# EAGLE design HoneyCar (EAGLE 7.2.0)
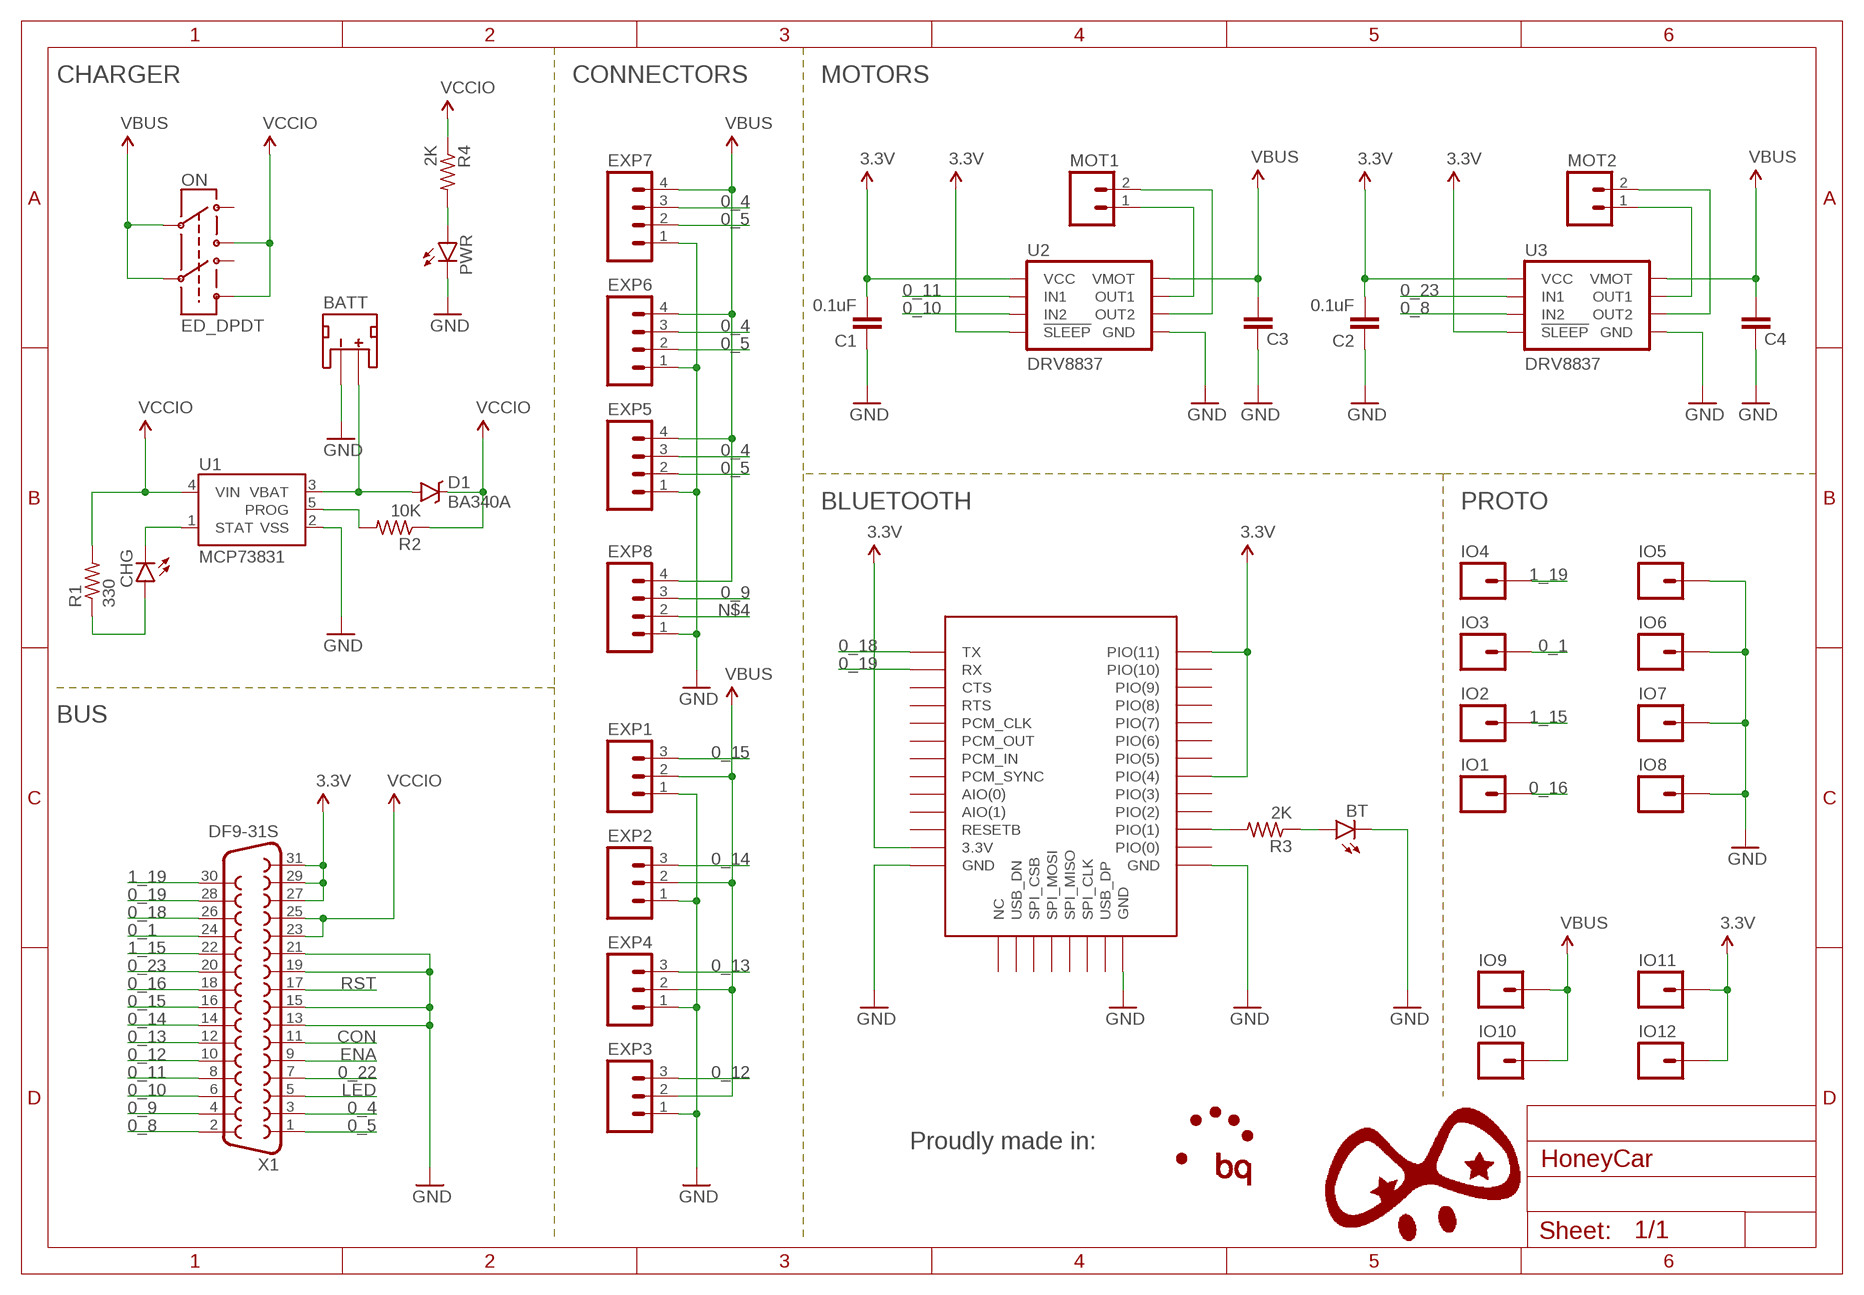
[diagram p0: schematic, sheet 1]

## Parts
BATT  JST_2MM_MALE  [JST-2-SMD]
BT  LED0603  [LED-0603]
C1  0.1uF  CAP0603-CAP  [0603-CAP]
C2  0.1uF  CAP0603-CAP  [0603-CAP]
C3  0.1uF  CAP0603-CAP  [0603-CAP]
C4  0.1uF  CAP0603-CAP  [0603-CAP]
CHG  LED0603  [LED-0603]
D1  BA340A  B340A  [SMA-DIODE]
EXP1  M03LOCK  [1X03_LOCK]
EXP2  M03LOCK  [1X03_LOCK]
EXP3  M03LOCK  [1X03_LOCK]
EXP4  M03LOCK  [1X03_LOCK]
EXP5  M04JST  [1X04-1.5MM_JST]
EXP6  M04JST  [1X04-1.5MM_JST]
EXP7  M04JST  [1X04-1.5MM_JST]
EXP8  M04JST  [1X04-1.5MM_JST]
IC1  BC04_BLUETOOTH  [BC04]
IO1  M01PTH_LONGPAD  [1X01_LONGPAD]
IO2  M01PTH_LONGPAD  [1X01_LONGPAD]
IO3  M01PTH_LONGPAD  [1X01_LONGPAD]
IO4  M01PTH_LONGPAD  [1X01_LONGPAD]
IO5  M01PTH_LONGPAD  [1X01_LONGPAD]
IO6  M01PTH_LONGPAD  [1X01_LONGPAD]
IO7  M01PTH_LONGPAD  [1X01_LONGPAD]
IO8  M01PTH_LONGPAD  [1X01_LONGPAD]
IO9  M01PTH_LONGPAD  [1X01_LONGPAD]
IO10  M01PTH_LONGPAD  [1X01_LONGPAD]
IO11  M01PTH_LONGPAD  [1X01_LONGPAD]
IO12  M01PTH_LONGPAD  [1X01_LONGPAD]
MOT1  M02POLAR  [MOLEX-1X2]
MOT2  M02POLAR  [MOLEX-1X2]
ON  ED_DPDT  [ED_DPDT]
PWR  LED0603  [LED-0603]
R1  330  R-US_R0402  [R0402]
R2  10K  R-US_R0402  [R0402]
R3  2K  R-US_R0402  [R0402]
R4  2K  R-US_R0402  [R0402]
U1  MCP73831  [SOT23-5]
U2  DRV8837  [DSG]
U3  DRV8837  [DSG]
X1  DF9-31S  [DF9-31S]

## Nets
0_1: IO3.1 X1.24
0_4: EXP5.3 EXP6.3 EXP7.3 X1.3
0_5: EXP5.2 EXP6.2 EXP7.2 X1.1
0_8: U3.5(IN2) X1.2
0_9: EXP8.3 X1.4
0_10: U2.5(IN2) X1.6
0_11: U2.6(IN1) X1.8
0_12: EXP3.3 X1.10
0_13: EXP4.3 X1.12
0_14: EXP2.3 X1.14
0_15: EXP1.3 X1.16
0_16: IO1.1 X1.18
0_18: IC1.P$1(TX) X1.26
0_19: IC1.P$2(RX) X1.28
0_22: X1.7
0_23: U3.6(IN1) X1.20
1_15: IO2.1 X1.22
1_19: IO4.1 X1.30
3.3V: C1.2 C2.2 IC1.P$12(3.3V) IC1.P$27(PIO(4)) IC1.P$34(PIO(11)) IO11.1 IO12.1 U2.7(!SLEEP) U2.8(VCC) U3.7(!SLEEP) U3.8(VCC) X1.27 X1.29 X1.31
CON: X1.11
ENA: X1.9
GND: BATT.1(-) BT.C C1.1 C2.1 C3.1 C4.1 EXP1.1 EXP2.1 EXP3.1 EXP4.1 EXP5.1 EXP6.1 EXP7.1 EXP8.1 IC1.P$13(GND) IC1.P$21(GND) IC1.P$22(GND) IO5.1 IO6.1 IO7.1 IO8.1 PWR.C U1.2(VSS) U2.4(GND) U2.PAD(GND) U3.4(GND) U3.PAD(GND) X1.13 X1.15 X1.19 X1.21
LED: X1.5
N$1: IC1.P$24(PIO(1)) R3.2
N$2: BT.A R3.1
N$3: PWR.A R4.2
N$4: EXP8.2
N$8: CHG.C U1.1(STAT)
N$9: CHG.A R1.1
N$10: R2.2 U1.5(PROG)
N$11: BATT.2(+) D1.A U1.3(VBAT)
N$29: MOT1.1 U2.2(OUT1)
N$30: MOT1.2 U2.3(OUT2)
N$31: MOT2.1 U3.2(OUT1)
N$32: MOT2.2 U3.3(OUT2)
RST: X1.17
VBUS: C3.2 C4.2 EXP1.2 EXP2.2 EXP3.2 EXP4.2 EXP5.4 EXP6.4 EXP7.4 EXP8.4 IO9.1 IO10.1 ON.2 ON.5 U2.1(VMOT) U3.1(VMOT)
VCCIO: D1.C ON.3 ON.6 R1.2 R2.1 R4.1 U1.4(VIN) X1.23 X1.25
Unconnected: BATT.NC1(PAD1) BATT.NC2(PAD2) IC1.P$3(CTS) IC1.P$4(RTS) IC1.P$5(PCM_CLK) IC1.P$6(PCM_OUT) IC1.P$7(PCM_IN) IC1.P$8(PCM_SYNC) IC1.P$9(AIO(0)) IC1.P$10(AIO(1)) IC1.P$11(RESETB) IC1.P$14(NC) IC1.P$15(USB_DN) IC1.P$16(SPI_CSB) IC1.P$17(SPI_MOSI) IC1.P$18(SPI_MISO) IC1.P$19(SPI_CLK) IC1.P$20(USB_DP) IC1.P$23(PIO(0)) IC1.P$25(PIO(2)) IC1.P$26(PIO(3)) IC1.P$28(PIO(5)) IC1.P$29(PIO(6)) IC1.P$30(PIO(7)) IC1.P$31(PIO(8)) IC1.P$32(PIO(9)) IC1.P$33(PIO(10)) ON.1 ON.4

## Notes on the sheet
- CHARGER | CONNECTORS | MOTORS
- BLUETOOTH | PROTO
- BUS
- Proudly made in:

## Library data of the parts
BATT = SparkFun-Connectors:JST_2MM_MALE: Mates to single-cell LiPo batteries. CONN-08352; PROD_ID: CONN-08352
BT CHG PWR = SparkFun-LED:LED: LEDs Standard schematic elements and footprints for 5mm, 3mm, 1206, and 0603 sized LEDs. 5mm - Spark Fun Electronics SKU : COM-00529 (and others)
C1-C4 = SparkFun-Passives:CAP: Capacitor Standard 0603 ceramic capacitor, and 0.1" leaded capacitor.
D1 = SparkFun-DiscreteSemi:B340A: Schottky Diode 3A-40V; PROD_ID: DIO-09886
EXP1-EXP4 = SparkFun-Connectors:M03: Header 3 Standard 3-pin 0.1" header. Use with straight break away headers (SKU : PRT-00116), right angle break away headers (PRT-00553), swiss pins (PRT-00743), machine pins (PRT-00117), and female headers (PRT-00115). Molex polarized connector foot print use with SKU : PRT-08232 with associated crimp pins and housings.
EXP5-EXP8 = SparkFun-Connectors:M04: Header 4 Standard 4-pin 0.1" header. Use with straight break away headers (SKU : PRT-00116), right angle break away headers (PRT-00553), swiss pins (PRT-00743), machine pins (PRT-00117), and female headers (PRT-00115). Molex polarized connector foot print use with SKU : PRT-08231 with associated crimp pins and housings. 1MM SMD Version SKU: PRT-10208
IC1 = bc04:BC04_BLUETOOTH; IC: BC04
IO1-IO12 = SparkFun-Connectors:M01: Header 1 Standard 1-pin 0.1" header. Use with straight break away headers (SKU : PRT-00116), right angle break away headers (PRT-00553), swiss pins (PRT-00743), machine pins (PRT-00117), and female headers (PRT-00115).
MOT1 MOT2 = SparkFun-Connectors:M02: Standard 2-pin 0.1" header. Use with - straight break away headers ( PRT-00116) - right angle break away headers (PRT-00553) - swiss pins (PRT-00743) - machine pins (PRT-00117) - female headers (PRT-00115) Molex polarized connector foot print use with: PRT-08233 with associated crimp pins and housings. 2.54_SCREWTERM for use with PRT-10571. 3.5mm Screw Terminal footprints for PRT-08084 5mm Screw Terminal footprints for use with PRT-08432
ON = pighiXXX:ED_DPDT
R1-R4 = resistor:R-US_: RESISTOR, American symbol
U1 = SparkFun-PowerIC:MCP73831: Miniature single cell, fully integrated Li-Ion, Li-polymer charge management controller http://ww1.microchip.com/downloads/en/DeviceDoc/21984a.pdf IC-09995; PROD_ID: IC-09995
U2 U3 = packages(ti):DRV8837
X1 = con-hirose:DF9-31S: SMD CONNECTOR Source: con-hirose.lbr from Bob Starr <rtzaudio@mindspring.com>; MPN: DF9-31S-1V(32); OC_FARNELL: 1798382; OC_NEWARK: 74R3383

## Board
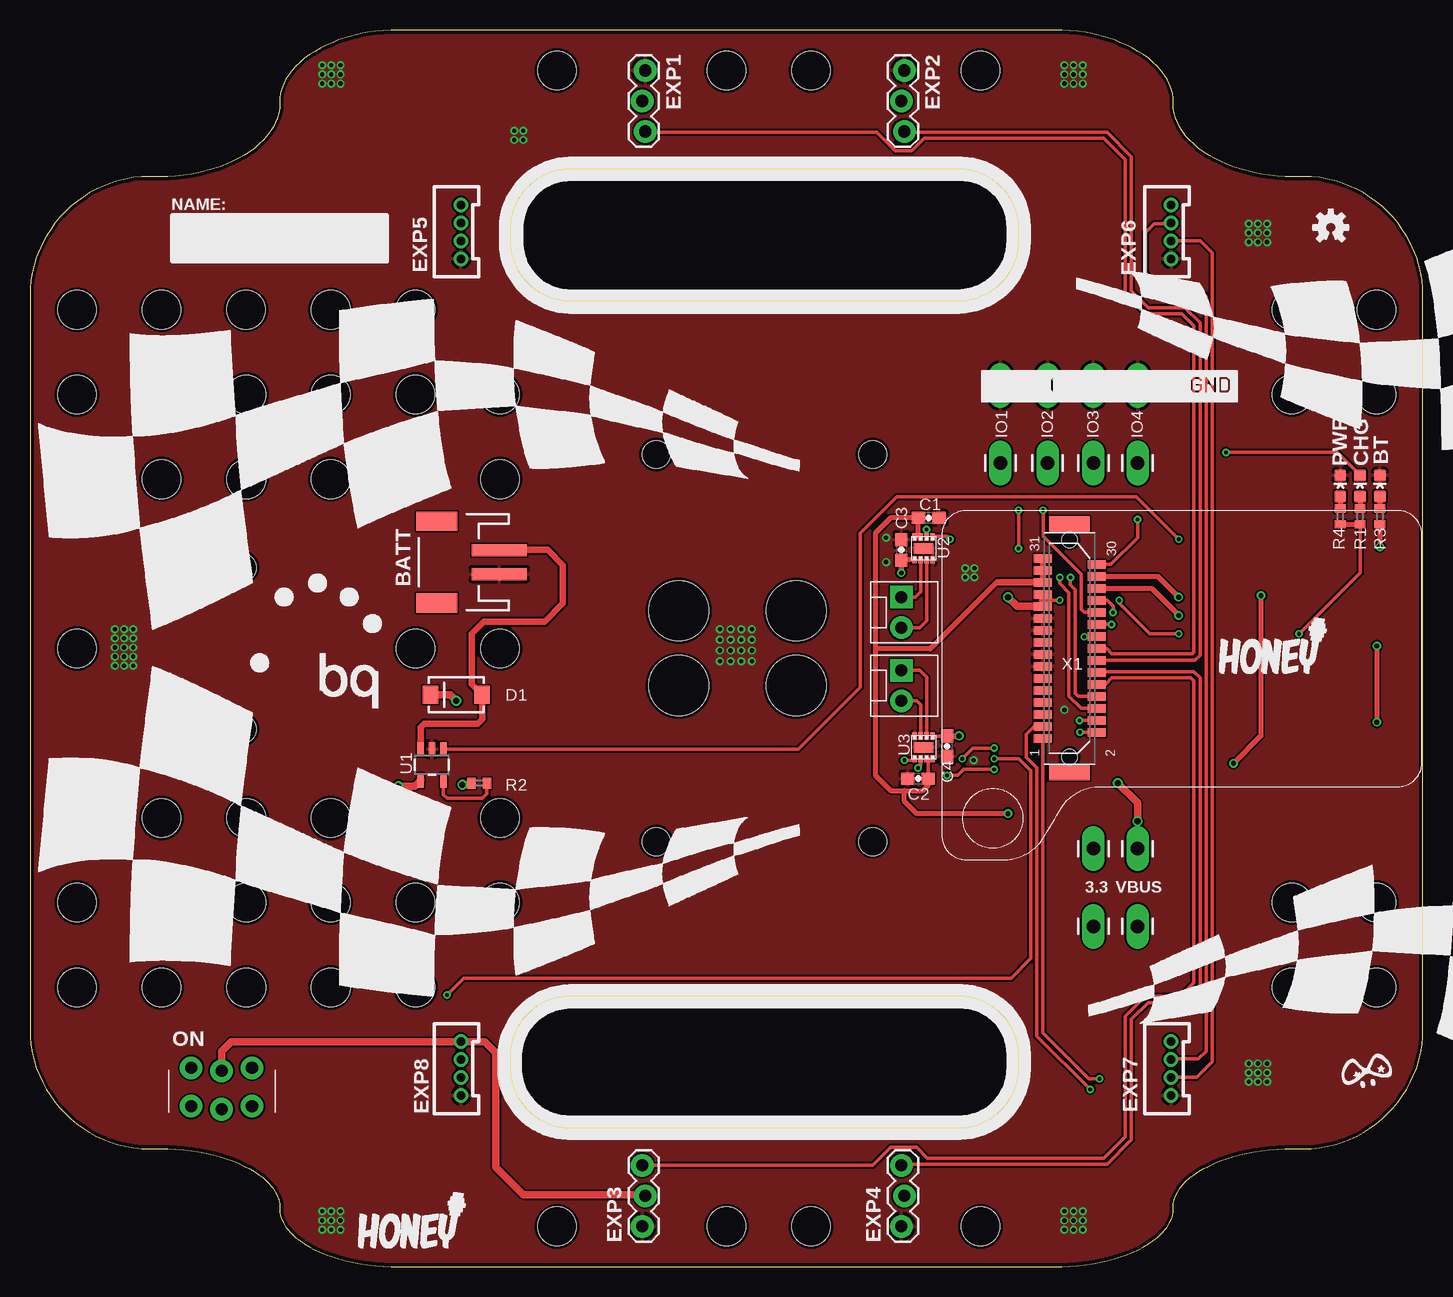
[diagram p1: board, top side]
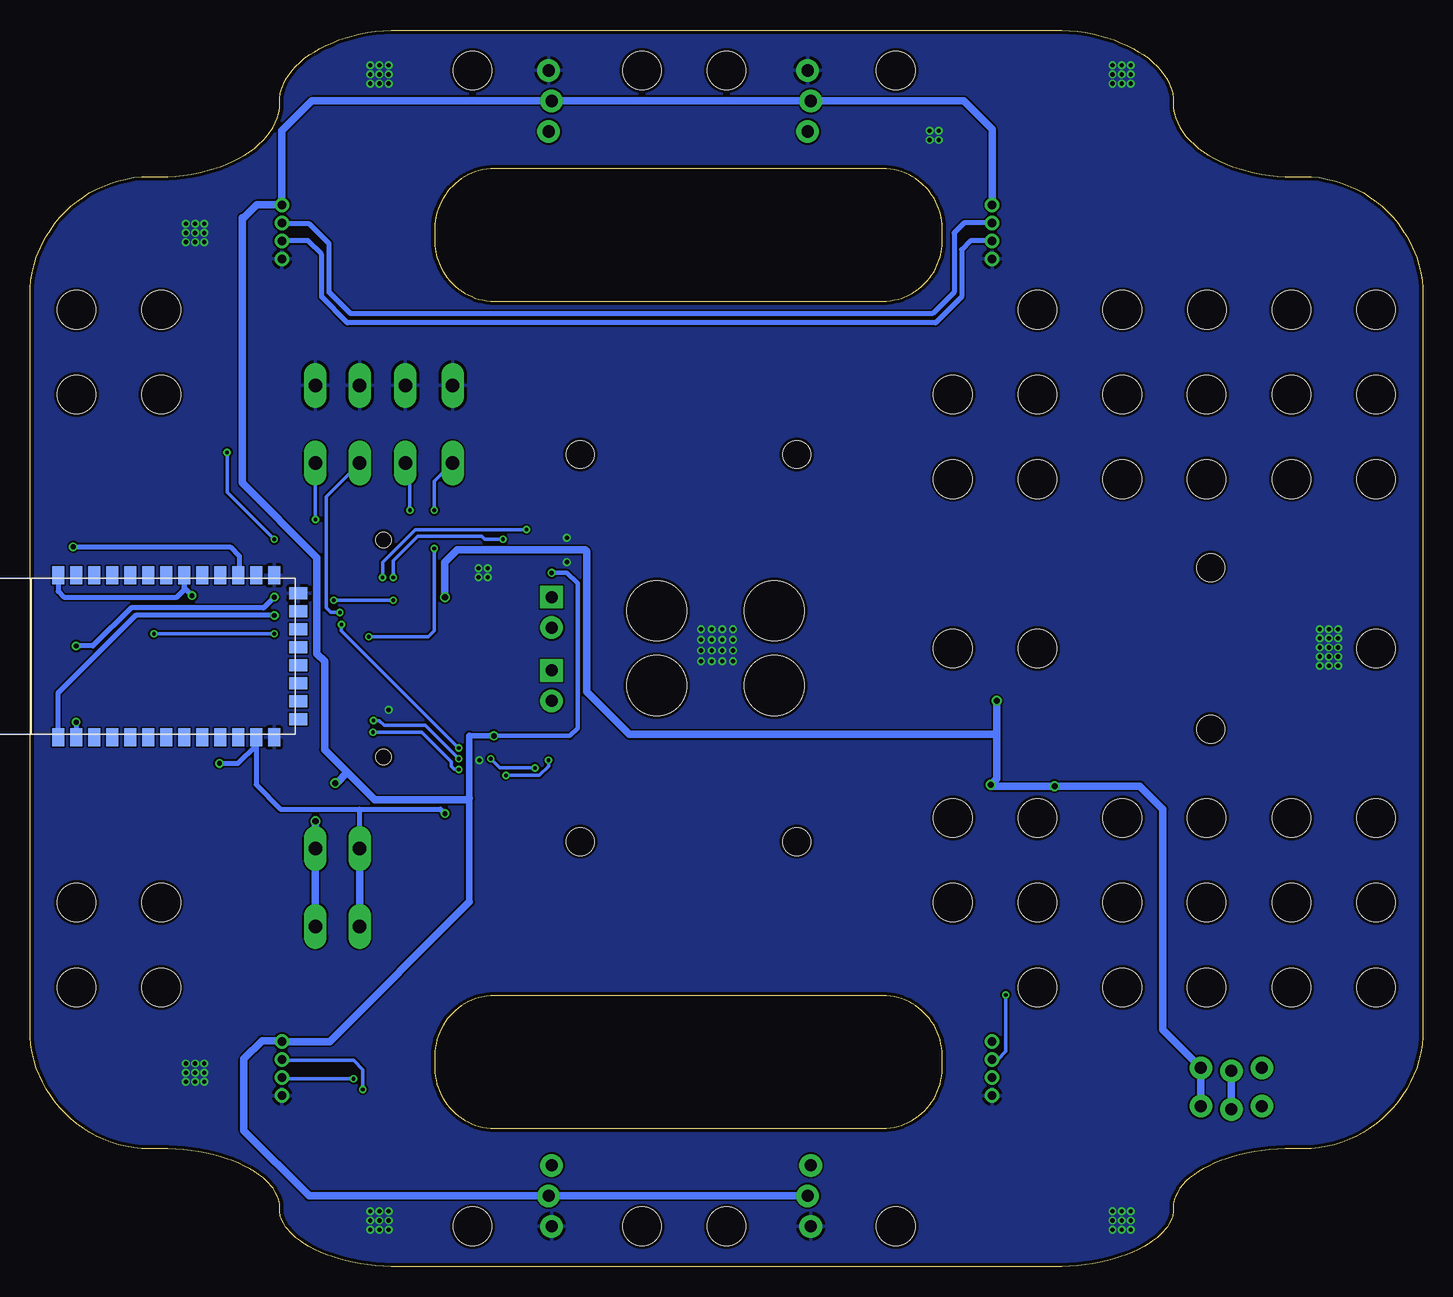
[diagram p2: board, bottom side, seen from below]

Size 116.08 x 103.07 mm. Coordinates in mm from the lower left corner, seen from the top.
Outline: 82.34,85.13 82.3,84.79 82.17,84.14 82.07,83.83 81.82,83.23 81.66,82.95 81.48,82.68 81.3,82.42 81.1,82.17 80.87,81.94 80.64,81.72 80.4,81.51 80.13,81.33 79.86,81.15 79.58,80.99 79.28,80.87 78.98,80.74 78.67,80.64 78.34,80.57 78.02,80.51 77.68,80.47 44.72,80.47 44.39,80.51 44.06,80.57 43.74,80.64 43.43,80.74 42.83,80.99 42.54,81.15 42.01,81.51 41.76,81.72 41.31,82.17 41.11,82.42 40.93,82.68 40.75,82.95 40.59,83.23 40.34,83.83 40.24,84.14 40.1,84.79 40.07,85.13 40.07,86.86 40.1,87.2 40.24,87.85 40.34,88.16 40.59,88.76 40.75,89.04 40.93,89.31 41.11,89.58 41.31,89.82 41.76,90.28 42.01,90.48 42.28,90.66 42.54,90.84 42.83,91 43.43,91.25 43.74,91.35 44.06,91.42 44.39,91.48 44.72,91.52 77.68,91.52 78.02,91.48 78.34,91.42 78.67,91.35 78.98,91.25 79.28,91.13 79.58,91 79.86,90.84 80.13,90.66 80.4,90.48 80.64,90.28 80.87,90.05 81.1,89.82 81.3,89.58 81.48,89.31 81.66,89.04 81.82,88.76 82.07,88.16 82.17,87.85 82.3,87.2 82.34,86.86 82.34,85.13
Outline: 82.34,16.21 82.3,15.87 82.24,15.55 82.17,15.23 82.07,14.91 81.82,14.31 81.66,14.03 81.48,13.76 81.3,13.5 81.1,13.25 80.87,13.02 80.64,12.8 80.4,12.59 80.13,12.41 79.86,12.23 79.58,12.08 79.28,11.95 78.98,11.82 78.67,11.72 78.34,11.66 78.02,11.59 77.68,11.55 44.72,11.55 44.39,11.59 44.06,11.66 43.74,11.72 43.43,11.82 42.83,12.08 42.54,12.23 42.01,12.59 41.76,12.8 41.54,13.02 41.31,13.25 41.11,13.5 40.93,13.76 40.75,14.03 40.59,14.31 40.34,14.91 40.24,15.23 40.17,15.55 40.1,15.87 40.07,16.21 40.07,17.95 40.1,18.28 40.17,18.61 40.24,18.93 40.34,19.24 40.59,19.84 40.75,20.13 40.93,20.39 41.11,20.66 41.31,20.91 41.76,21.36 42.01,21.56 42.28,21.74 42.54,21.92 42.83,22.08 43.43,22.33 43.74,22.43 44.06,22.5 44.39,22.57 44.72,22.6 77.68,22.6 78.02,22.57 78.67,22.43 78.98,22.33 79.28,22.21 79.58,22.08 79.86,21.92 80.13,21.74 80.4,21.56 80.64,21.36 80.87,21.13 81.1,20.91 81.3,20.66 81.66,20.13 81.82,19.84 82.07,19.24 82.17,18.93 82.24,18.61 82.3,18.28 82.34,17.95 82.34,16.21
Outline: 116.08,81.54 116.01,82.21 115.88,82.86 115.74,83.51 115.55,84.14 115.04,85.34 114.73,85.9 114.37,86.44 114.01,86.97 113.6,87.46 112.69,88.37 112.19,88.78 111.66,89.14 111.13,89.5 110.56,89.81 109.37,90.32 108.74,90.52 108.09,90.65 107.44,90.78 106.77,90.86 104.6,90.86 103.93,90.9 103.28,90.98 102.63,91.06 102,91.18 100.81,91.49 100.24,91.68 99.71,91.9 99.18,92.12 98.68,92.37 98.23,92.65 97.77,92.93 97.36,93.23 97,93.55 96.64,93.88 96.33,94.23 95.82,94.96 95.63,95.34 95.49,95.74 95.36,96.13 95.29,96.54 95.29,97.38 95.22,97.8 95.09,98.19 94.95,98.59 94.75,98.97 94.25,99.7 93.94,100.05 93.58,100.37 93.21,100.7 92.8,101 92.35,101.28 91.9,101.56 91.4,101.81 90.87,102.03 90.34,102.25 89.77,102.44 88.57,102.75 87.95,102.87 87.3,102.95 86.65,103.03 85.98,103.07 30.1,103.07 29.43,103.03 28.78,102.95 28.13,102.87 27.51,102.75 26.31,102.44 25.74,102.25 25.21,102.03 24.68,101.81 24.18,101.56 23.73,101.28 23.28,101 22.87,100.7 22.51,100.37 22.15,100.05 21.83,99.7 21.33,98.97 21.13,98.59 21,98.19 20.86,97.8 20.79,97.38 20.79,96.54 20.72,96.13 20.59,95.74 20.45,95.34 20.26,94.96 19.75,94.23 19.44,93.88 19.08,93.55 18.72,93.23 18.31,92.93 17.85,92.65 17.4,92.37 16.91,92.12 16.37,91.9 15.84,91.68 15.27,91.49 14.08,91.18 13.45,91.06 12.8,90.98 12.15,90.9 11.48,90.86 9.31,90.86 8.64,90.78 7.99,90.65 7.34,90.52 6.71,90.32 5.52,89.81 4.95,89.5 4.42,89.14 3.89,88.78 3.39,88.37 2.48,87.46 2.07,86.97 1.71,86.44 1.35,85.9 1.04,85.34 0.53,84.14 0.34,83.51 0.2,82.86 0.07,82.21 0,81.54 0,19.17 0.07,18.49 0.2,17.85 0.34,17.2 0.53,16.57 1.04,15.37 1.35,14.81 1.71,14.27 2.07,13.74 2.48,13.24 3.39,12.34 3.89,11.93 4.42,11.57 4.95,11.21 5.52,10.9 6.12,10.64 6.71,10.39 7.34,10.19 7.99,10.06 8.64,9.92 9.31,9.85 11.48,9.85 12.15,9.82 12.8,9.75 13.45,9.69 14.08,9.59 14.67,9.47 15.27,9.34 15.84,9.19 16.37,9.01 16.91,8.83 17.4,8.63 17.85,8.41 18.31,8.18 18.72,7.94 19.08,7.68 19.44,7.41 19.75,7.13 20.26,6.55 20.45,6.24 20.59,5.92 20.72,5.6 20.79,5.27 20.79,4.59 20.86,4.26 21,3.94 21.13,3.62 21.33,3.31 21.83,2.72 22.15,2.44 22.51,2.18 22.87,1.92 23.28,1.67 23.73,1.45 24.18,1.22 24.68,1.02 25.21,0.84 25.74,0.67 26.31,0.51 26.91,0.39 27.51,0.26 28.13,0.17 28.78,0.1 29.43,0.03 30.1,0 85.98,0 86.65,0.03 87.3,0.1 87.95,0.17 88.57,0.26 89.17,0.39 89.77,0.51 90.34,0.67 90.87,0.84 91.4,1.02 91.9,1.22 92.35,1.45 92.8,1.67 93.21,1.92 93.58,2.18 93.94,2.44 94.25,2.72 94.75,3.31 94.95,3.62 95.09,3.94 95.22,4.26 95.29,4.59 95.29,5.27 95.36,5.6 95.49,5.92 95.63,6.24 95.82,6.55 96.33,7.13 96.64,7.41 97,7.68 97.36,7.94 97.77,8.18 98.23,8.41 98.68,8.63 99.18,8.83 99.71,9.01 100.24,9.19 100.81,9.34 101.41,9.47 102,9.59 102.63,9.69 103.28,9.75 103.93,9.82 104.6,9.85 106.77,9.85 107.44,9.92 108.09,10.06 108.74,10.19 109.37,10.39 109.96,10.64 110.56,10.9 111.13,11.21 111.66,11.57 112.19,11.93 112.69,12.34 113.6,13.24 114.01,13.74 114.37,14.27 114.73,14.81 115.04,15.37 115.55,16.57 115.74,17.2 115.88,17.85 116.01,18.49 116.08,19.17 116.08,81.54
Copper layers (1*16): Top 0.035mm / dielectric 1.5mm / Bottom 0.035mm
Design rules "pighixxx_CAM_DRC_V1.0": minimum track width 6mil, minimum drill 12mil, track to track 6mil, track to pad 6mil, pad to pad 6mil, via to via 6mil, smd to smd 0mil, copper to edge 10mil, drill to drill 10mil, minimum pad ring 10mil, minimum via ring 6mil, stop-mask expansion 2mil, vias tented up to drill 100mil, thermal gap 10mil
Holes 2.3 mm at 52.19,67.7 70.22,67.7 52.19,35.44 70.22,35.44 17.69,58.27 17.69,44.81
Holes 3.2 mm at 43.93,99.7 58.05,99.7 65.09,99.7 79.21,99.7 43.93,3.38 58.05,3.38 65.09,3.38 79.21,3.38 10.96,79.76 18,79.76 25.06,79.76 32.12,79.76 3.9,79.76 18.02,72.7 25.06,72.7 32.12,72.7 39.18,72.7 10.96,72.7 3.9,72.7 10.96,65.64 18.02,65.64 25.06,65.64 32.12,65.64 3.9,65.64 39.18,65.64 32.12,51.54 39.18,51.54 3.9,51.54 10.96,37.42 18.02,37.42 25.06,37.42 32.12,37.42 3.9,37.42 18.02,30.36 25.06,30.36 32.12,30.36 39.18,30.36 10.96,30.36 3.9,30.36 10.96,23.3 18.02,23.3 25.06,23.3 32.12,23.3 3.9,23.3 39.18,37.42 105.15,79.76 112.21,79.76 105.15,72.7 112.21,72.7 105.15,30.36 112.21,30.36 105.15,23.3 112.21,23.3
Holes 5 mm at 63.85,54.67 63.85,48.44 54.07,54.67 54.07,48.44

### Footprints (pad centres in the part's own frame; a part is rotated, then mirrored left to right if it is on the bottom)
JST-2-SMD = smd 1 x 4.6: 1 -1,-3.7; 2 1,-3.7 | smd 1.6 x 3.4: NC1 -3.4,1.5; NC2 3.4,1.5
LED-0603 = smd 1 x 1: A 0,-0.877; C 0,0.877
0603-CAP = smd 1.1 x 1: 1 -0.85,0; 2 0.85,0
SMA-DIODE = smd 1.27 x 1.47: A -2.15,0; C 2.15,0
1X03_LOCK = drill 1.016 pad 1.88: 1 0,0.127; 2 2.54,-0.127; 3 5.08,0.127
1X04-1.5MM_JST = drill 0.7: 1 0,0; 2 1.5,0; 3 3,0; 4 4.5,0
BC04 = smd 1 x 1.5: P$1 7,-0.25; P$2 8.5,-0.25; P$3 10,-0.25; P$4 11.5,-0.25; P$5 13,-0.25; P$6 14.5,-0.25; P$7 16,-0.25; P$8 17.5,-0.25; P$9 19,-0.25; P$10 20.5,-0.25; P$11 22,-0.25; P$12 23.5,-0.25; P$13 25,-0.25; P$22 25,13.25; P$23 23.5,13.25; P$24 22,13.25; P$25 20.5,13.25; P$26 19,13.25; P$27 17.5,13.25; P$28 16,13.25; P$29 14.5,13.25; P$30 13,13.25; P$31 11.5,13.25; P$32 10,13.25; P$33 8.5,13.25; P$34 7,13.25 | smd 1.5 x 1: P$14 27,1.25; P$15 27,2.75; P$16 27,4.25; P$17 27,5.75; P$18 27,7.25; P$19 27,8.75; P$20 27,10.25; P$21 27,11.75
1X01_LONGPAD = drill 1.118 pad 1.88 long: 1 0,0
MOLEX-1X2 = drill 1.016 pad 1.88 square: 1 0,0 | drill 1.016 pad 1.88: 2 2.54,0
ED_DPDT = drill 1.016 pad 1.88: 1 -2.54,-1.397; 2 0,-1.651; 3 2.54,-1.397; 4 -2.54,1.803; 5 0,1.549; 6 2.54,1.803
R0402 = smd 0.7 x 0.9: 1 -0.65,0; 2 0.65,0
SOT23-5 = smd 0.55 x 1.2: 1 -0.95,-1.3; 2 0,-1.3; 3 0.95,-1.3; 4 0.95,1.3; 5 -0.95,1.3
DSG = smd 0.6 x 0.35: 1 -0.95,0.75; 2 -0.95,0.25; 3 -0.95,-0.25; 4 -0.95,-0.75; 5 0.95,-0.75; 6 0.95,-0.25; 7 0.95,0.25; 8 0.95,0.75 | smd 0.9 x 1.6: PAD 0,0
DF9-31S = smd 0.7 x 1.5: 1 -7.5,2.25; 2 -7,-2.25; 3 -6.5,2.25; 4 -6,-2.25; 5 -5.5,2.25; 6 -5,-2.25; 7 -4.5,2.25; 8 -4,-2.25; 9 -3.5,2.25; 10 -3,-2.25; 11 -2.5,2.25; 12 -2,-2.25; 13 -1.5,2.25; 14 -1,-2.25; 15 -0.5,2.25; 16 0,-2.25; 17 0.5,2.25; 18 1,-2.25; 19 1.5,2.25; 20 2,-2.25; 21 2.5,2.25; 22 3,-2.25; 23 3.5,2.25; 24 4,-2.25; 25 4.5,2.25; 26 5,-2.25; 27 5.5,2.25; 28 6,-2.25; 29 6.5,2.25; 30 7,-2.25; 31 7.5,2.25 | smd 1.3 x 3.4: M1 -10.35,0; M2 10.35,0 | hole 1.27: 9.05,0; -9.05,0

### Placement (x,y rotation side)
BATT  35.4,58.73 90 top
BT  112.49,65.08 0 top
C1  74.89,62.41 180 top
C2  74.01,40.7 0 top
C3  72.61,59.75 270 top
C4  76.42,43.39 90 top
CHG  110.84,65.08 0 top
D1  35.52,47.68 180 top
EXP1  51.15,99.7 270 top
EXP2  72.74,99.7 270 top
EXP3  51.15,3.38 90 top
EXP4  72.74,3.38 90 top
EXP5  35.91,84 90 top
EXP6  95.09,84 90 top
EXP7  95.09,14.28 90 top
EXP8  35.91,14.28 90 top
IC1  120.74,44.38 0 bottom
IO1  80.86,66.99 0 top
IO2  84.8,66.99 0 top
IO3  88.61,66.99 0 top
IO4  92.29,66.99 0 top
IO5  80.86,73.46 0 top
IO6  84.8,73.46 0 top
IO7  88.61,73.46 0 top
IO8  92.29,73.46 0 top
IO9  92.29,34.85 0 top
IO10  92.29,28.38 0 top
IO11  88.61,34.85 0 top
IO12  88.61,28.38 0 top
LOGO1  OSHW-LOGOS  [OSHW-LOGO-S]  108.4,86.62 0 top
MOT1  72.61,55.81 270 top
MOT2  72.61,49.71 270 top
ON  15.97,14.79 0 top
PWR  109.18,65.08 0 top
R1  110.84,62.54 270 top
R2  37.43,40.32 0 top
R3  112.49,62.54 270 top
R4  109.18,62.54 90 top
U1  33.49,41.84 180 top
U2  74.46,59.87 90 top
U3  74.46,43.29 270 top
U$5  [LOGO_MEDIUM]  99.1,49.41 0 top
U$7  [LOGO_MEDIUM]  27.35,1.53 0 top
U$8  [BQ_LOGO]  18.38,46.54 0 top
U$9  [PIGHIXXX_LOGO]  109.31,14.92 0 top
U$10  [S_KICIK_GND_1]  90.77,71.81 0 top
U$11  [S_KICIK_GND_1]  85.05,71.81 0 top
U$12  [S_KICIK_GND_1]  79.09,71.81 0 top
U$14  [CAR_RACING_BIG]  0.73,22.54 0 top
U$15  [CAR_RACING_BIG]  150.59,126.17 180 top  (outside the outline)
U$16  [CAR_RACING_BIG]  151.6,35.24 180 top  (outside the outline)
X1  86.63,51.54 90 top

### Tracks (layer width: path | path; a pad name or v marks a point on that pad's centre or on a via)
0_1  (via drill 0.3)
  Top 0.305: X1.24 89.77,55.54 90.26,55.05 v90.26,54.54
  Bottom 0.305: IO3.1 91.4,64.19 91.4,54.92 91.02,54.54 v90.26,54.54
0_4  (via drill 0.3)
  Top 0.305: X1.3 83.69,45.04 83.02,44.38 83.02,42.47 83.91,41.59 83.91,19.23 v88.36,14.79 | EXP7.3 95.14,17.33 97.37,17.33 98.01,17.96 98.01,80.83 97.25,81.59 94.2,81.59 92.93,82.86 92.93,86.16 93.69,86.92 95.01,86.92 EXP6.3
  Bottom 0.305: v88.36,14.79 88.36,16.44 89.12,17.2 95.01,17.2 EXP7.3
  Bottom 0.406: EXP5.3 38.24,87 39.08,86.16 39.08,81.21 40.86,79.43 89.37,79.43 91.15,81.21 91.15,85.27 92.8,86.92 95.01,86.92 EXP6.3
0_5  (via drill 0.3)
  Top 0.305: X1.1 84.38,19.53 88.23,15.68 v89.12,15.68 | 94.98,15.68 EXP7.2 95.11,15.8 97.25,15.8 98.52,17.07 98.52,84.51 97.52,85.5 EXP6.2
  Bottom 0.305: v89.12,15.68 94.98,15.68 EXP7.2
  Bottom 0.406: EXP5.2 37.71,85.5 38.45,84.77 38.45,80.83 40.6,78.67 89.63,78.67 91.79,80.83 91.79,84.38 92.93,85.53 95.06,85.53 EXP6.2
0_8  (via drill 0.3)
  Top 0.305: X1.2 87.51,44.54 v87.49,44.56 | v80.36,41.46 77.82,41.46 77.31,40.95 v76.42,40.95 | v72.86,42.22 73.6,42.22 U3.5
  Bottom 0.305: v87.49,44.56 83.45,44.56 80.99,42.09 80.99,41.71 80.74,41.46 v80.36,41.46 | v76.42,40.95 73.62,40.95 72.86,41.71 v72.86,42.22
0_9  (via drill 0.3)
  Top 0.305: X1.4 87.49,45.54 v87.47,45.52 | v80.36,42.35 82.39,42.35 83.4,41.33 83.4,25.71 81.75,24.06 36.16,24.06 v34.76,22.66
  Bottom 0.305: v87.47,45.52 86.96,45.52 86.58,45.14 83.15,45.14 v80.36,42.35 | v34.76,22.66 34.76,17.96 35.45,17.28 EXP8.3
0_10  (via drill 0.3)
  Top 0.305: U2.5 75.28,60.89 76.42,60.89 v76.67,60.64 | v85.82,57.46 85.82,56.95 86.58,56.19 86.58,47.55 87.59,46.54 X1.6
  Bottom 0.305: v76.67,60.64 78.2,60.64 78.45,60.89 83.78,60.89 85.82,58.86 v85.82,57.46
0_11  (via drill 0.3)
  Top 0.305: U2.6 v74.71,61.44 v74.72,61.45 | X1.8 88.87,47.55 87.34,47.55 87.09,47.81 87.09,56.44 86.71,56.83 v86.71,57.46
  Bottom 0.305: v74.72,61.45 83.99,61.45 86.71,58.73 v86.71,57.46
0_12
  Top 0.305: X1.10 88.91,48.57 89.63,48.57 90.13,49.08 96.74,49.08 96.99,48.82 96.99,23.68 95.85,22.54 92.93,22.54 91.28,20.88 91.28,10.85 89.5,9.07 74.77,9.07 73.88,9.96 71.72,9.96 70.22,8.46 EXP3.3
0_13
  Top 0.305: X1.12 88.92,49.59 96.99,49.59 97.5,49.08 97.5,23.42 96.1,22.03 93.18,22.03 91.79,20.63 91.79,10.6 89.75,8.57 72.71,8.57 EXP4.3
0_14
  Top 0.305: X1.14 97.06,50.54 97.5,50.98 97.5,78.67 96.23,79.94 93.18,79.94 91.79,81.34 91.79,92.51 89.75,94.54 72.94,94.54 EXP2.3
0_15
  Top 0.305: EXP1.3 51.35,94.54 70.58,94.54 72.1,93.02 73.5,93.02 74.51,94.04 89.5,94.04 91.28,92.26 91.28,81.08 92.93,79.43 95.98,79.43 96.99,78.42 96.99,51.24 96.87,51.11 90.13,51.11 89.75,51.49 88.93,51.49 X1.16
0_16  (via drill 0.3)
  Top 0.305: X1.18 88.84,52.51 v87.85,52.51 | v82.39,59.87 v82.39,63.05
  Bottom 0.305: v87.85,52.51 82.9,52.51 82.39,53.02 v82.39,59.87 | v82.39,63.05 82.39,65.46 IO1.1
0_18  (via drill 0.41)
  Top 0.406: X1.26 93.47,56.54 v95.72,54.29
  Bottom 0.406: v95.72,54.29 107.28,54.29 113.76,47.81 113.76,44.14 IC1.P$1
0_19  (via drill 0.41)
  Top 0.406: X1.28 93.99,57.54 v95.72,55.81 | v112.23,51.75 v112.23,45.4
  Bottom 0.406: v95.72,55.81 96.61,54.92 107.66,54.92 110.84,51.75 v112.23,51.75 | v112.23,45.4 IC1.P$2
0_23  (via drill 0.3)
  Top 0.305: X1.20 90.12,53.54 v90.13,53.52 | v80.36,43.24 78.58,43.24 v77.69,42.35 | v74.01,41.59 74.21,41.79 U3.6
  Bottom 0.305: v90.13,53.52 90.13,53.02 v80.36,43.24 | v77.69,42.35 76.93,41.59 v74.01,41.59
1_15  (via drill 0.3)
  Top 0.305: X1.22 87.85,54.54 87.59,54.79 87.59,57.71 84.42,60.89 v84.42,63.05
  Bottom 0.305: v84.42,63.05 84.42,66.6 IO2.1
1_19  (via drill 0.3)
  Top 0.305: X1.30 90.07,58.54 92.29,60.76 v92.29,62.29
  Bottom 0.305: v92.29,62.29 IO4.1
3.3V  (via drill 0.41)
  Top 0.305: 80.65,57.04 80.61,57.08 | U2.8 U2.7 74.04,60.99 C1.2 | U3.8 U3.7 74.86,42.19 C2.2
  Top 0.406: U2.7 74.01,61.03 74.01,62.41 71.72,62.41 70.45,61.14 70.45,51.49 | 70.45,51.49 70.45,40.95 71.72,39.68 72.86,39.68 | 72.86,39.68 74.39,39.68 74.89,40.19 74.89,40.66 C2.2 | 80.61,57.08 75.02,51.49 70.45,51.49 | v81.5,37.78 73.88,37.78 72.86,38.79 72.86,39.68 | v102.58,55.94 102.58,44.25 v100.29,41.97
  Top 0.508: X1.31 X1.29 X1.27
  Top 0.559: X1.27 80.65,57.04
  Bottom 0.406: IC1.P$12 97.24,43.49 | 97.24,43.49 97.24,40.18 95.21,38.16 88.61,38.16 | 88.61,38.16 81.88,38.16 v81.5,37.78 | IC1.P$34 113.74,56.3 113.25,55.81 103.85,55.81 103.22,56.44 103.22,57.6 IC1.P$27 103.24,56.6 v102.58,55.94 | v100.29,41.97 98.77,41.97 97.24,43.49 | IO11.1 88.61,38.16
  Bottom 0.61: IO12.1 IO11.1
GND  (via drill 0.36)
  other vias: 24.35,100.13 25.11,100.13 25.11,99.37 24.35,99.37 78.7,57.46 77.94,57.46 77.94,58.22 78.7,58.22 71.34,60.76 71.34,58.73 40.35,94.67 41.11,94.67 41.11,93.91 40.35,93.91 101.56,16.95 101.56,16.19 102.33,16.19 102.33,16.95 103.09,16.95 103.09,16.19 103.09,15.42 102.33,15.42 101.56,15.42 25.87,100.13 25.87,99.37 25.87,98.61 25.11,98.61 24.35,98.61 86.2,100.13 86.96,100.13 87.72,100.13 87.72,99.37 86.96,99.37 86.2,99.37 86.2,98.61 86.96,98.61 87.72,98.61 24.35,3.1 25.11,3.1 25.87,3.1 25.87,3.87 25.11,3.87 24.35,3.87 24.35,4.63 25.11,4.63 25.87,4.63 86.2,3.1 86.2,3.87 86.2,4.63 86.96,4.63 86.96,3.87 86.96,3.1 87.72,3.1 87.72,3.87 87.72,4.63 57.5,53.14 58.38,53.14 59.27,53.14 60.16,53.14 60.16,52.25 59.27,52.25 58.38,52.25 57.5,52.25 57.5,51.36 58.38,51.36 59.27,51.36 60.16,51.36 60.16,50.48 59.27,50.48 58.38,50.48 57.5,50.48 86.2,46.41 78.63,42.22 101.56,86.92 102.33,86.92 103.09,86.92 103.09,86.16 102.33,86.16 101.56,86.16 101.56,85.4 102.33,85.4 103.09,85.4 7.08,53.14 7.08,52.38 7.08,51.62 7.08,50.86 7.08,50.09 7.84,53.14 7.84,52.38 7.84,51.62 7.84,50.86 7.84,50.09 8.6,53.14 8.6,52.38 8.6,51.62 8.6,50.86 8.6,50.09
  pour Top: -0.54,103.82 103.85,103.82 116.68,103.82 116.68,1.83 116.68,-0.58 -0.54,-0.58
  pour Bottom: -0.54,-0.58 -0.54,103.82 113.63,103.82 116.68,103.82 116.68,-0.71 0.22,-0.71
N$1  (via drill 0.41)
  Top 0.406: R3.2 v112.49,60
  Bottom 0.406: v112.49,60 99.41,60 98.64,59.24 98.64,57.73 IC1.P$24
N$2
  Top 0.406: BT.A R3.1
N$3
  Top 0.406: PWR.A R4.2
N$8  (via drill 0.3)
  Top 0.305: 34.54,43.24 U1.1 64,43.14 69.18,48.32 69.18,61.14 72.23,64.19 92.17,64.19 v95.72,60.64 | CHG.C 108.92,67.87 v99.66,67.87
  Bottom 0.305: v99.66,67.87 99.66,64.57 v95.72,60.64
N$9
  Top 0.406: CHG.A R1.1
N$10
  Top 0.305: U1.5 34.44,39.37 34.76,39.05 37.68,39.05 38.06,39.43 38.06,40.3 R2.2
N$11
  Top 0.305: D1.A
  Top 0.559: U1.3 32.54,44.95 32.86,45.27 37.3,45.27 37.68,45.65 D1.A | D1.A 36.79,48.56 36.79,52.76 37.81,53.78 42.89,53.78 44.41,55.3 44.41,58.48 43.14,59.75 39.11,59.75 BATT.2
N$29
  Top 0.305: U2.2 74.21,56.27 73.75,55.81 MOT1.1
N$30
  Top 0.305: U2.3 74.71,53.85 74.13,53.27 MOT1.2
N$31
  Top 0.305: U3.2 74.71,49.13 74.13,49.71 MOT2.1
N$32
  Top 0.305: U3.3 74.21,46.84 73.88,47.17 MOT2.2
VBUS  (via drill 0.38, 0.46, 0.51)
  Top 0.305: C3.2 72.64,58.92 U2.1 | U3.1 C4.2
  Top 0.406: U2.1 72.61,58.92 v72.61,57.84 | v77.43,44.25 77.42,44.24
  Top 0.457: 77.42,44.24 C4.2
  Top 0.61: EXP3.2 51.17,6.03 41.11,6.03 38.83,8.31 38.83,17.84 37.88,18.78 EXP8.4 16.78,18.78 15.97,17.96 ON.5 | v92.29,37.14 92.29,38.66 v90.64,40.32
  Bottom 0.381: v77.43,44.25 71.08,44.25 70.45,44.89 70.45,56.95 71.34,57.84 v72.61,57.84
  Bottom 0.457: 79.47,44.25 v77.43,44.25
  Bottom 0.559: 79.47,30.41 79.47,39.05 79.47,44.25
  Bottom 0.61: EXP3.2 EXP4.2 92.83,5.92 98.26,11.36 98.26,17.33 96.74,18.85 95.16,18.85 EXP7.4 91.1,18.78 79.47,30.41 | EXP5.4 35.91,94.8 38.27,97.16 EXP1.2 EXP2.2 92.6,97.16 95.09,94.67 EXP6.4 97.19,88.5 98.26,87.43 98.39,87.43 98.39,65.33 92.17,59.11 92.17,51.11 91.53,50.48 91.53,43.11 89.63,41.2 | 89.63,41.2 87.34,38.92 79.59,38.92 79.47,39.05 | ON.5 ON.2 | IO10.1 IO9.1 v92.29,37.14 | v90.64,40.32 90.52,40.32 89.63,41.2
VCCIO  (via drill 0.3, 0.51)
  Top 0.305: 84.42,55.56 v85.82,55.56 | v95.72,52.76 93.31,52.76 90.77,55.3 v90.77,55.56 | v105.76,52.76 110.84,57.84 R1.2
  Top 0.406: X1.25 84.42,56 84.42,55.56 | R4.1 R1.2
  Top 0.61: X1.25 X1.23 82.27,55.04 v81.5,55.81 | v30.7,40.06 32.06,40.06 U1.4 | D1.C 35.02,47.68 v35.52,47.17 | v36.03,40.19 36.65,40.19 R2.1
  Bottom 0.305: v85.82,55.56 v90.77,55.56 | v95.72,52.76 v105.76,52.76
  Bottom 0.61: v81.5,55.81 81.5,58.73 80.48,59.75 69.81,59.75 69.69,59.62 69.69,47.94 66.13,44.38 35.52,44.38 | ON.3 ON.6 21.68,19.77 21.68,38.16 23.59,40.06 v30.7,40.06 35.91,40.06 v36.03,40.19 35.52,40.7 35.52,44.38 | v35.52,47.17 35.52,44.38

### Text on the board
tNames: NAME: | 3.3 | VBUS